# EAGLE design HeartBoard (EAGLE 6.4)
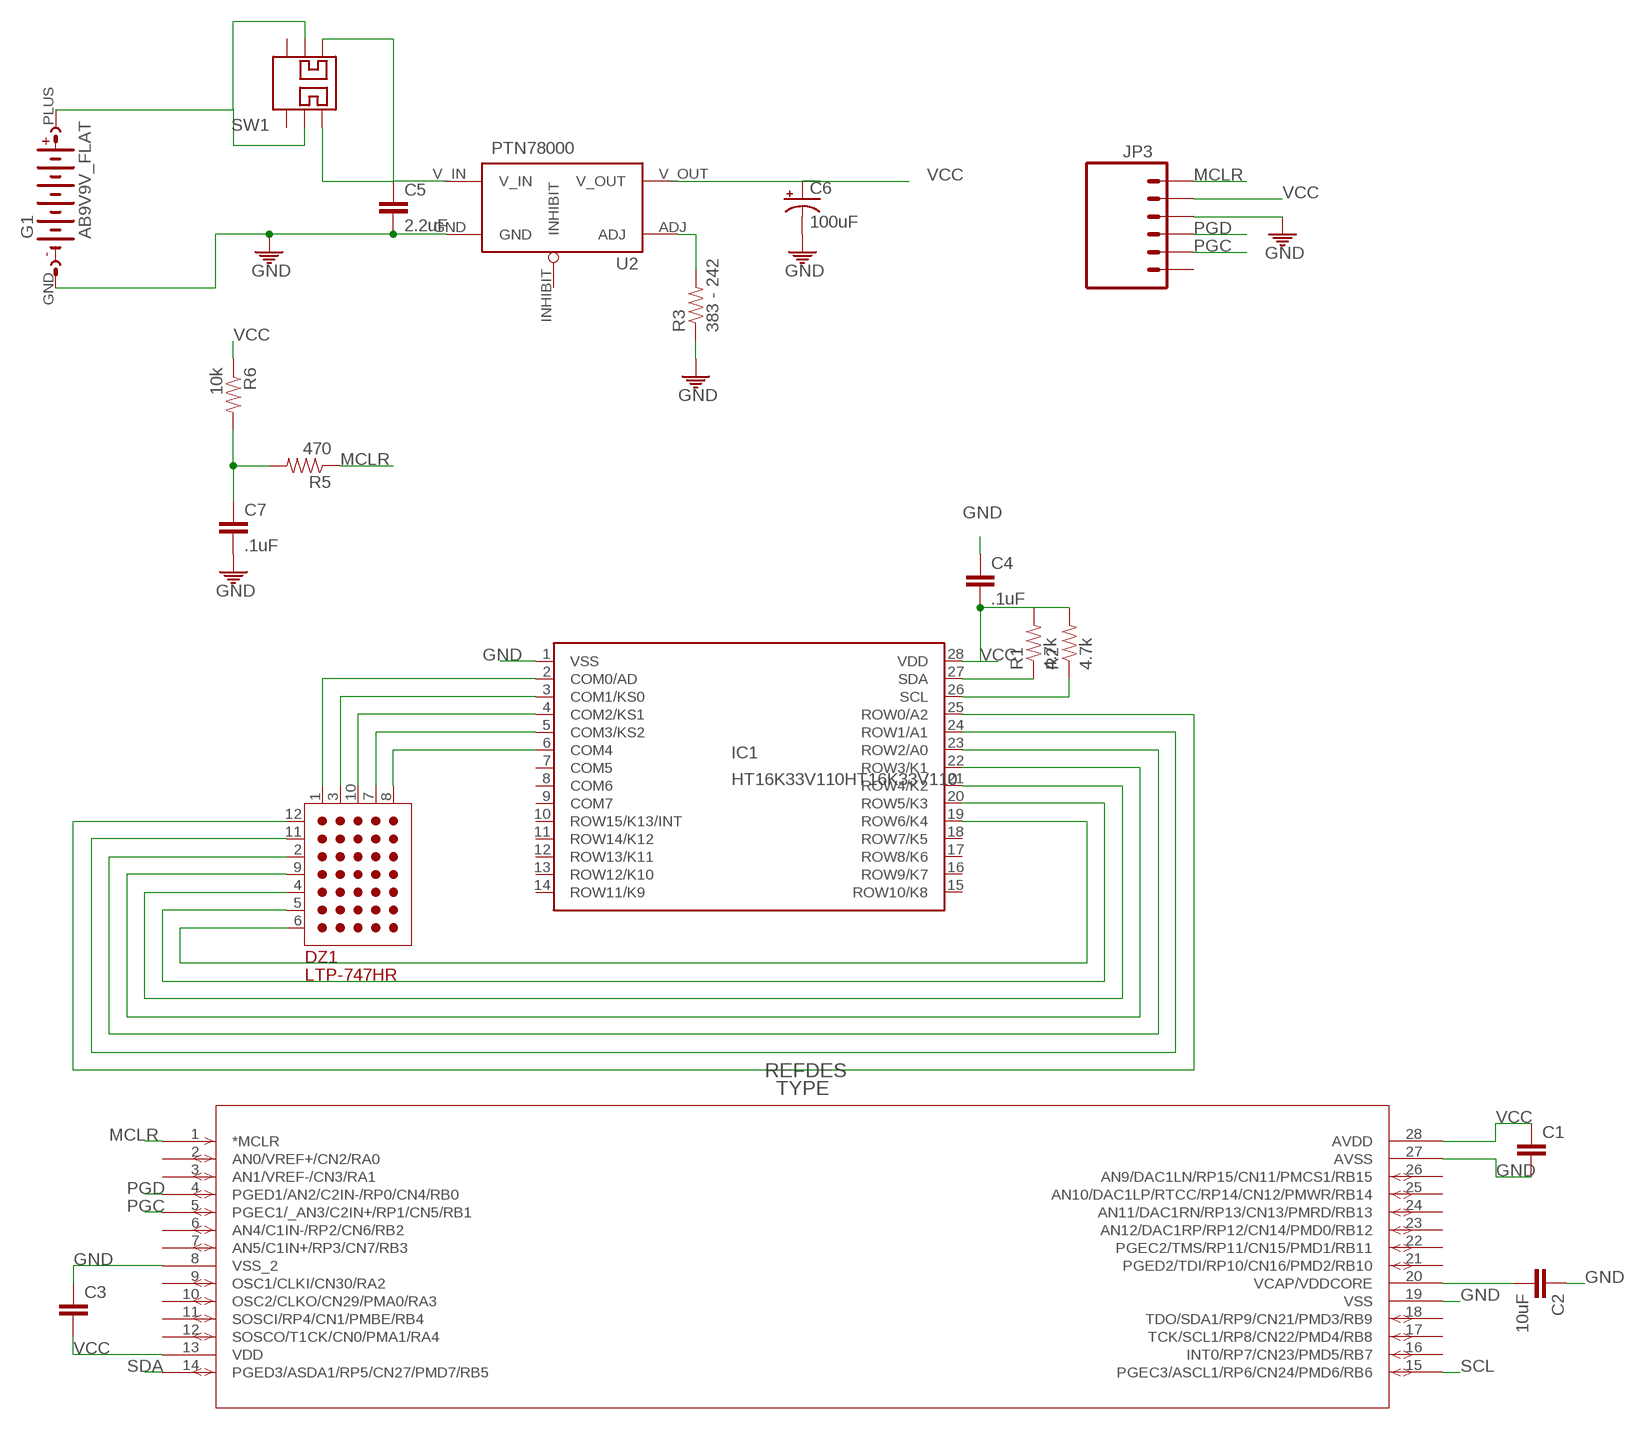
[diagram p0: schematic, sheet 1]

## Parts
C1  CAP1206  [1206]
C2  10uF  CAP1206  [1206]
C3  CAP1206  [1206]
C4  .1uF  CAP1206  [1206]
C5  2.2uF  CAP1206  [1206]
C6  100uF  CAP_POLPTH1  [CPOL-RADIAL-100UF-25V]
C7  .1uF  CAP1206  [1206]
DZ1  LTP-747HR  [LTP-747HR]
G1  AB9V9V_FLAT  [BH9VPC]
IC1  HT16K33V110HT16K33V110  [SOP28]
JP3  M06LOCK  [1X06_LOCK]
R1  4.7k  RESISTOR0805-RES  [0805]
R2  4.7k  RESISTOR0805-RES  [0805]
R3  383 - 242  RESISTOR0805-RES  [0805]
R5  470  RESISTOR0805-RES  [0805]
R6  10k  RESISTOR0805-RES  [0805]
SW1  SLIDE_SWITCH_DPDTTOP  [EG2207]
U2  PTN78000  PTN78000THROUGH-HOLE  [PTN78000]
U$1  DSPIC33FJ64GP802  [SOIC28-W_MC]

## Nets
GND: C1.2 C2.1 C3.1 C4.1 C5.2 C6.2(-) C7.2 G1.GND(-) IC1.1(VSS) JP3.3 R3.1 U2.GND U$1.8(VSS_2) U$1.19(VSS) U$1.27(AVSS)
MCLR: JP3.1 R5.1 U$1.1(*MCLR)
N$1: DZ1.1(C1) IC1.2(COM0/AD)
N$2: C7.1 R5.2 R6.2
N$3: C2.2 U$1.20(VCAP/VDDCORE)
N$4: G1.PLUS(+) SW1.P$2 SW1.P$5
N$6 [power]: R3.2 U2.ADJ
N$8: DZ1.3(C2) IC1.3(COM1/KS0)
N$9: DZ1.10(C3) IC1.4(COM2/KS1)
N$10: DZ1.7(C4) IC1.5(COM3/KS2)
N$11: DZ1.8(C5) IC1.6(COM4)
N$12: DZ1.12(R1) IC1.25(ROW0/A2)
N$13: DZ1.11(R2) IC1.24(ROW1/A1)
N$14: DZ1.2(R3) IC1.23(ROW2/A0)
N$15: DZ1.9(R4) IC1.22(ROW3/K1)
N$16: DZ1.4(R5) IC1.21(ROW4/K2)
N$17: DZ1.5(R6) IC1.20(ROW5/K3)
N$18: DZ1.6(R7) IC1.19(ROW6/K4)
PGC: JP3.5 U$1.5(PGEC1/_AN3/C2IN+/RP1/CN5/RB1)
PGD [small]: JP3.4 U$1.4(PGED1/AN2/C2IN-/RP0/CN4/RB0)
PVDD [power]: C5.1 SW1.P$1 SW1.P$4 U2.V_IN
SCL: IC1.26(SCL) R2.1 U$1.15(PGEC3/ASCL1/RP6/CN24/PMD6/RB6)
SDA: IC1.27(SDA) R1.1 U$1.14(PGED3/ASDA1/RP5/CN27/PMD7/RB5)
VCC: C1.1 C3.2 C4.2 C6.1(+) IC1.28(VDD) JP3.2 R1.2 R2.2 R6.1 U2.V_OUT U$1.13(VDD) U$1.28(AVDD)
Unconnected: IC1.7(COM5) IC1.8(COM6) IC1.9(COM7) IC1.10(ROW15/K13/INT) IC1.11(ROW14/K12) IC1.12(ROW13/K11) IC1.13(ROW12/K10) IC1.14(ROW11/K9) IC1.15(ROW10/K8) IC1.16(ROW9/K7) IC1.17(ROW8/K6) IC1.18(ROW7/K5) JP3.6 SW1.P$3 SW1.P$6 U2.INHIBIT U$1.2(AN0/VREF+/CN2/RA0) U$1.3(AN1/VREF-/CN3/RA1) U$1.6(AN4/C1IN-/RP2/CN6/RB2) U$1.7(AN5/C1IN+/RP3/CN7/RB3) U$1.9(OSC1/CLKI/CN30/RA2) U$1.10(OSC2/CLKO/CN29/PMA0/RA3) U$1.11(SOSCI/RP4/CN1/PMBE/RB4) U$1.12(SOSCO/T1CK/CN0/PMA1/RA4) U$1.16(INT0/RP7/CN23/PMD5/RB7) U$1.17(TCK/SCL1/RP8/CN22/PMD4/RB8) U$1.18(TDO/SDA1/RP9/CN21/PMD3/RB9) U$1.21(PGED2/TDI/RP10/CN16/PMD2/RB10) U$1.22(PGEC2/TMS/RP11/CN15/PMD1/RB11) U$1.23(AN12/DAC1RP/RP12/CN14/PMD0/RB12) U$1.24(AN11/DAC1RN/RP13/CN13/PMRD/RB13) U$1.25(AN10/DAC1LP/RTCC/RP14/CN12/PMWR/RB14) U$1.26(AN9/DAC1LN/RP15/CN11/PMCS1/RB15)

## Library data of the parts
C1-C4 = ASL:CAP: Capacitor Standard 0603 ceramic capacitor, and 0.1" leaded capacitor.
C5 C7 = CMPE118lib:CAP: Capacitor Standard 0603 ceramic capacitor, and 0.1" leaded capacitor.
C6 = ASL:CAP_POL: Capacitor Polarized These are standard SMD and PTH capacitors. Normally 10uF, 47uF, and 100uF in electrolytic and tantalum varieties. Always verify the external diameter of the through hole cap, it varies with capacity, voltage, and manufacturer. The EIA devices should be standard.
DZ1 = pavlo:LTP-747HR: 5x7 Dot Matrix LED Display
G1 = ASL:AB9V: 9-V BATTERY CLIP
IC1 = pavlo:HT16K33V110: edit this description Auto generated by make-symbol-device-package-bsdl.ulp Rev. 43 Source:
JP3 = CMPE118lib:M06: Header 6 Standard 6-pin 0.1" header. Use with straight break away headers (SKU : PRT-00116), right angle break away headers (PRT-00553), swiss pins (PRT-00743), machine pins (PRT-00117), and female headers (PRT-00115). Molex polarized connector foot print use with SKU : PRT-08094 with associated crimp pins and housings. NOTES ON THE VARIANTS LOCK and LOCK_LONGPADS... This footprint was designed to help hold the alignment of a through-hole component (i.e. 6-pin header) while soldering it into place. You may notice that each hole has been shifted either up or down by 0.005 of an inch from it's more standard position (which is a perfectly straight line). This slight alteration caused the pins (the squares in the middle) to touch the edges of the holes. Because they are alternating, it causes a "brace" to hold the component in place. 0.005 has proven to be the perfect amount of "off-center" position when using our standard breakaway headers. Although looks a little odd when you look at the bare footprint, once you have a header in there, the alteration is very hard to notice. Also, if you push a header all the way into place, it is covered up entirely on the bottom side. This idea of altering the position of holes to aid alignment will be further integrated into the Sparkfun Library for other footprints. It can help hold any component with 3 or more connection pins.
R1 R2 = ASL:RESISTOR: Resistor Basic schematic elements and footprints for 0603, 1206, and PTH resistors.
R3 R5 R6 = CMPE118lib:RESISTOR: Resistor Basic schematic elements and footprints for 0603, 1206, and PTH resistors.
SW1 = ASL:SLIDE_SWITCH_DPDT
U2 = ASL:PTN78000: This is the PTN78000 part by Texas Instruments. It's a 1.5A adjustable switching regulator.
U$1 = pavlo:DSPIC33FJ64GP802

## Net classes
0 default: width 0.406 mm
1 power: width 0.762 mm, clearance 0.254 mm to class 0, clearance 0.508 mm
2 small: width 0.254 mm, clearance 0.254 mm to class 1

## Board
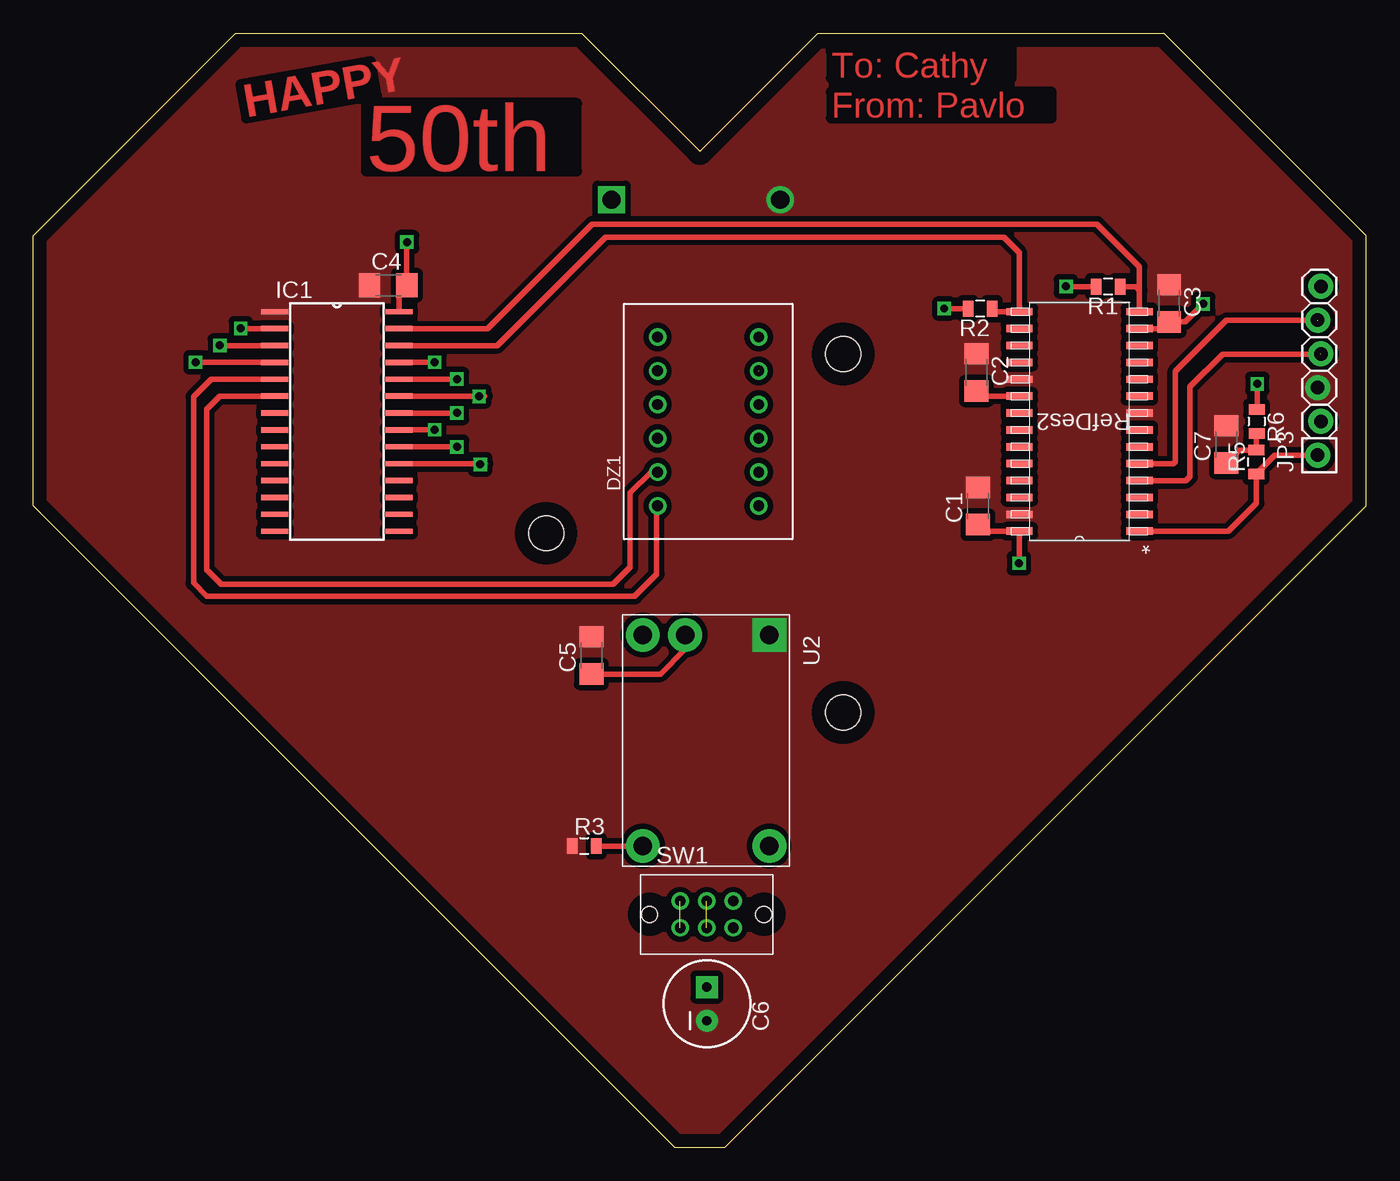
[diagram p1: board, top side]
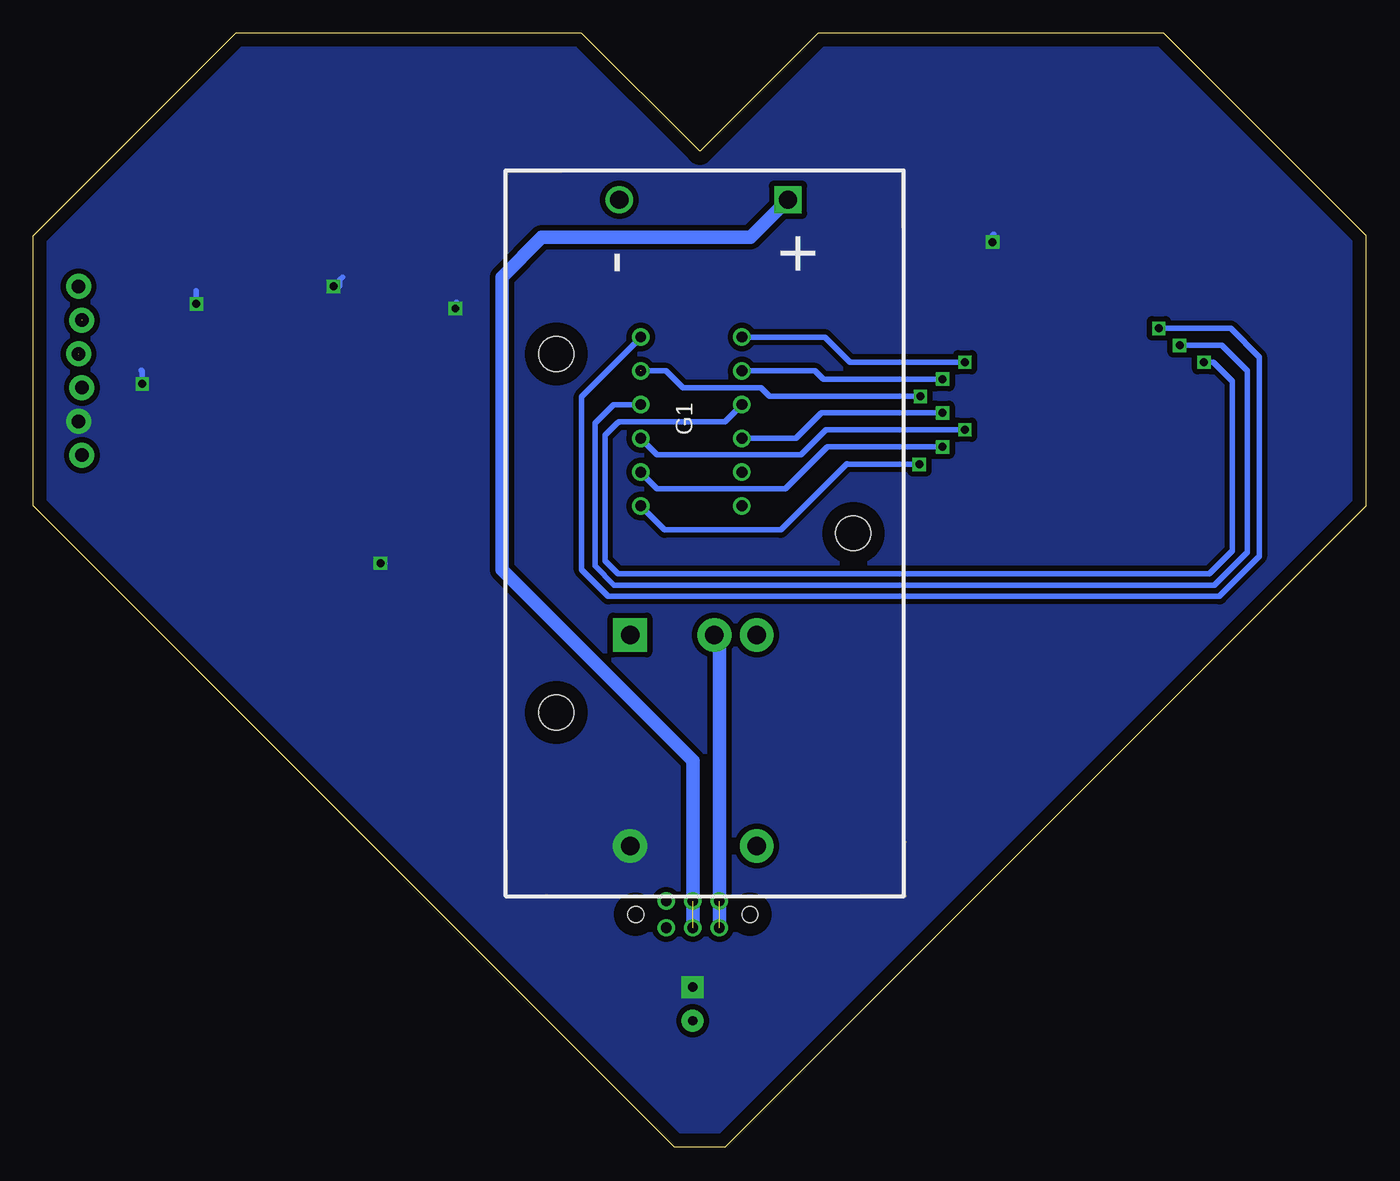
[diagram p2: board, bottom side, seen from below]

Size 100.33 x 83.82 mm. Coordinates in mm from the lower left corner, seen from the top.
Outline: 48.26,0 0,48.26 0,68.58 15.24,83.82 41.28,83.82 50.17,74.93 59.06,83.82 85.09,83.82 100.33,68.58 100.33,48.26 52.07,0 48.26,0
Copper layers (1*16): Top 0.035mm / dielectric 1.5mm / Bottom 0.035mm
Design rules "default": minimum track width 10mil, minimum drill 24mil, track to track 8mil, track to pad 8mil, pad to pad 8mil, via to via 8mil, smd to smd 8mil, copper to edge 40mil, drill to drill 8mil, minimum pad ring 10mil, minimum via ring 8mil, stop-mask expansion 4mil, vias tented up to drill 0mil, thermal gap 10mil

### Footprints (pad centres in the part's own frame; a part is rotated, then mirrored left to right if it is on the bottom)
1206 = smd 1.6 x 1.8: 1 -1.4,0; 2 1.4,0
CPOL-RADIAL-100UF-25V = drill 0.7 pad 1.651 square: 1 1.27,0 | drill 0.7 pad 1.651: 2 -1.27,0
LTP-747HR = drill 0.813: 1 -3.81,-6.35; 2 -3.81,-3.81; 3 -3.81,-1.27; 4 -3.81,1.27; 5 -3.81,3.81; 6 -3.81,6.35; 7 3.81,6.35; 8 3.81,3.81; 9 3.81,1.27; 10 3.81,-1.27; 11 3.81,-3.81; 12 3.81,-6.35
BH9VPC = drill 1.372: GND 24.3,5.42 | drill 1.372 square: PLUS 24.3,-7.28 | hole 2.642: 12.7,10.16; -14.275,10.16; -0.787,-12.192
SOP28 = smd 2.032 x 0.4: 1 -4.675,8.255; 2 -4.675,6.985; 3 -4.675,5.715; 4 -4.675,4.445; 5 -4.675,3.175; 6 -4.675,1.905; 7 -4.675,0.635; 8 -4.675,-0.635; 9 -4.675,-1.905; 10 -4.675,-3.175; 11 -4.675,-4.445; 12 -4.675,-5.715; 13 -4.675,-6.985; 14 -4.675,-8.255; 15 4.675,-8.255; 16 4.675,-6.985; 17 4.675,-5.715; 18 4.675,-4.445; 19 4.675,-3.175; 20 4.675,-1.905; 21 4.675,-0.635; 22 4.675,0.635; 23 4.675,1.905; 24 4.675,3.175; 25 4.675,4.445; 26 4.675,5.715; 27 4.675,6.985; 28 4.675,8.255
1X06_LOCK = drill 1.016 pad 1.88: 1 0,0.127; 2 2.54,-0.127; 3 5.08,0.127; 4 7.62,-0.127; 5 10.16,0.127; 6 12.7,-0.127
0805 = smd 0.8 x 1.2: 1 -0.9,0; 2 0.9,0
EG2207 = drill 0.8: P$1 -2,1; P$2 0,1; P$3 2,1; P$4 -2,-1; P$5 0,-1; P$6 2,-1 | hole 1.2: 4.3,0; -4.3,0
PTN78000 = drill 1.397 pad 2.54: ADJ 15.875,-9.525; INHIBIT 0,-9.525; V_IN 0,-6.35; V_OUT 15.875,0 | drill 1.397 pad 2.54 square: GND 0,0
SOIC28-W_MC = smd 1.981 x 0.559: 1 -4.521,8.255; 2 -4.521,6.985; 3 -4.521,5.715; 4 -4.521,4.445; 5 -4.521,3.175; 6 -4.521,1.905; 7 -4.521,0.635; 8 -4.521,-0.635; 9 -4.521,-1.905; 10 -4.521,-3.175; 11 -4.521,-4.445; 12 -4.521,-5.715; 13 -4.521,-6.985; 14 -4.521,-8.255; 15 4.521,-8.255; 16 4.521,-6.985; 17 4.521,-5.715; 18 4.521,-4.445; 19 4.521,-3.175; 20 4.521,-1.905; 21 4.521,-0.635; 22 4.521,0.635; 23 4.521,1.905; 24 4.521,3.175; 25 4.521,4.445; 26 4.521,5.715; 27 4.521,6.985; 28 4.521,8.255

### Placement (x,y rotation side)
C1  71.1,48.25 90 top
C2  71,58.31 270 top
C3  85.49,63.5 270 top
C4  26.72,64.86 0 top
C5  42.01,37.01 90 top
C6  50.7,10.79 90 top
C7  89.8,52.89 90 top
DZ1  50.8,54.61 180 top
G1  50.8,46.99 90 bottom
IC1  22.86,54.61 0 top
JP3  96.79,52.07 90 top
R1  80.9,64.75 180 top
R2  71.26,63.1 180 top
R3  41.47,22.67 0 top
R5  92.05,51.56 90 top
R6  92.08,54.61 270 top
SW1  50.69,17.52 0 top
U2  55.41,38.54 270 top
U$1  78.74,54.61 180 top

### Tracks (layer width: path | path; a pad name or v marks a point on that pad's centre or on a via)
GND
  pour Top (isolate 0.406, no thermals): -1.27,85.09 101.6,85.09 101.6,-1.27 -1.27,-1.27
MCLR
  Top 0.406: U$1.1 89.95,46.36 92.06,48.46 R5.1 93.46,52.07 JP3.1
N$1  (via drill 0.6)
  Top 0.406: IC1.2 15.62,61.6 v15.61,61.61
  Bottom 0.406: DZ1.1 54.62,60.9 59.06,56.46 59.06,43.46 57.06,41.46 11.06,41.46 8.06,44.46 8.06,59.46 10.21,61.61 v15.61,61.61
N$2
  Top 0.406: R6.2 92.05,53.69 R5.2 90.77,52.46 C7.1
N$3
  Top 0.406: U$1.20 71.39,56.52 C2.2
N$4  (1 unrouted)
  Bottom 1.016: SW1.P$5 50.69,29.09 65.06,43.46 65.06,65.46 62.06,68.46 46.35,68.46 G1.PLUS
N$6
  Top 0.406: U2.ADJ R3.2
N$8  (via drill 0.6)
  Top 0.406: IC1.3 v14.04,60.33
  Bottom 0.406: DZ1.3 56.64,55.88 58.06,54.46 58.06,43.75 56.6,42.29 11.43,42.29 8.94,44.78 8.94,58.41 10.86,60.33 v14.04,60.33
N$9  (via drill 0.6)
  Top 0.406: IC1.4 12.22,59.05 v12.21,59.07
  Bottom 0.406: DZ1.10 48.27,54.6 56.25,54.6 56.33,54.52 56.34,54.52 57.28,53.58 57.28,44.12 56.31,43.15 11.81,43.15 10.08,44.88 10.08,57.62 11.53,59.07 v12.21,59.07
N$10
  Top 0.406: IC1.5 13.39,57.79 12.06,56.46 12.06,42.46 13.06,41.46 45.26,41.46 46.92,43.12 46.92,48.19 DZ1.7 46.96,48.23
N$11
  Top 0.406: IC1.6 14.04,56.52 13.06,55.54 13.06,43.45 14.14,42.37 43.65,42.37 44.92,43.64 44.92,49.24 46.48,50.8 DZ1.8
N$12  (via drill 0.6)
  Top 0.406: IC1.25 30.19,59.05 v30.21,59.07
  Bottom 0.406: DZ1.12 40.75,60.96 38.84,59.05 38.83,59.07 v30.21,59.07
N$13  (via drill 0.6)
  Top 0.406: DZ1.11 | IC1.24 31.87,57.79 v31.89,57.8
  Bottom 0.406: DZ1.11 41.48,58.42 40.84,57.79 40.83,57.8 v31.89,57.8
N$14  (via drill 0.6)  (1 unrouted)
  Top 0.406: IC1.23 33.98,56.52 v33.56,56.5
  Bottom 0.406: DZ1.2 52.7,58.41 51.43,57.14 45.57,57.14 44.93,56.5 v33.56,56.5
N$15  (via drill 0.6)
  Top 0.406: IC1.22 31.82,55.24 v31.89,55.26
  Bottom 0.406: DZ1.9 42.91,53.34 40.99,55.26 v31.89,55.26
N$16  (via drill 0.6)
  Top 0.406: IC1.21 30,53.98 v30.21,53.99
  Bottom 0.406: DZ1.4 53.37,52.1 42.54,52.1 40.65,53.99 v30.21,53.99
N$17  (via drill 0.6)
  Top 0.406: IC1.20 31.83,52.7 v31.89,52.7
  Bottom 0.406: DZ1.5 53.37,49.56 43.7,49.56 40.56,52.7 40.55,52.7 v31.89,52.7
N$18  (via drill 0.6)
  Top 0.406: IC1.19 34.03,51.44 v33.64,51.38
  Bottom 0.406: DZ1.6 52.81,46.46 44.06,46.46 39.09,51.44 39.03,51.38 v33.64,51.38
PGC  (1 unrouted)
  Top 0.406: U$1.5 85.83,51.44 85.96,51.57 85.96,58.38 89.8,62.22 JP3.5
PGD  (1 unrouted)
  Top 0.406: U$1.4 86.77,50.16 87.06,50.46 87.06,57.21 89.53,59.68 96.91,59.68
PVDD  (1 unrouted)
  Top 0.406: C5.1 47.21,35.61 49.06,37.46 U2.V_IN
  Bottom 1.016: SW1.P$4 48.69,38.17 U2.V_IN
SCL
  Top 0.406: IC1.26 34.92,60.33 43.06,68.46 73.06,68.46 74.22,67.3 U$1.15 72.39,62.87 R2.1
SDA
  Top 0.406: U$1.14 83.26,64.46 | 83.26,64.46 83.26,66.26 80.06,69.46 42.06,69.46 34.19,61.6 IC1.27 | R1.1 82.97,64.75 83.26,64.46
VCC  (via drill 0.6)
  Top 0.406: R6.1 92.12,55.46 v92.12,57.44 v92.13,57.44 | C1.1 71.59,46.36 U$1.28 74.22,43.97 v74.19,43.94 | IC1.28 27.54,64.27 C4.2 v28.12,68.1 v28.13,68.11 | U$1.13 84.98,61.6 C3.2 86.7,62.1 v88.06,63.46 | R1.2 77.75,64.75 v77.73,64.77 | R2.2 v68.57,63.1 v68.56,63.11
  Bottom 0.406: v92.13,57.44 92.13,58.4 92.2,58.47 | v28.13,68.11 28.13,68.6 28.04,68.69 | v88.06,63.46 88.06,64.46 | v74.19,43.94 73.88,43.94 73.85,43.91 | v77.73,64.77 77.26,64.77 77.26,65.26 77.06,65.46 | v68.56,63.11 68.56,63.47 68.45,63.58
  pour Bottom (isolate 0.406, no thermals): -1.27,85.09 101.6,85.09 101.6,-1.27 -1.27,-1.27

### Text on the board
Top: To: Cathy | HAPPY | From: Pavlo | 50th